# EAGLE design RCPCell (EAGLE 6.5.0)
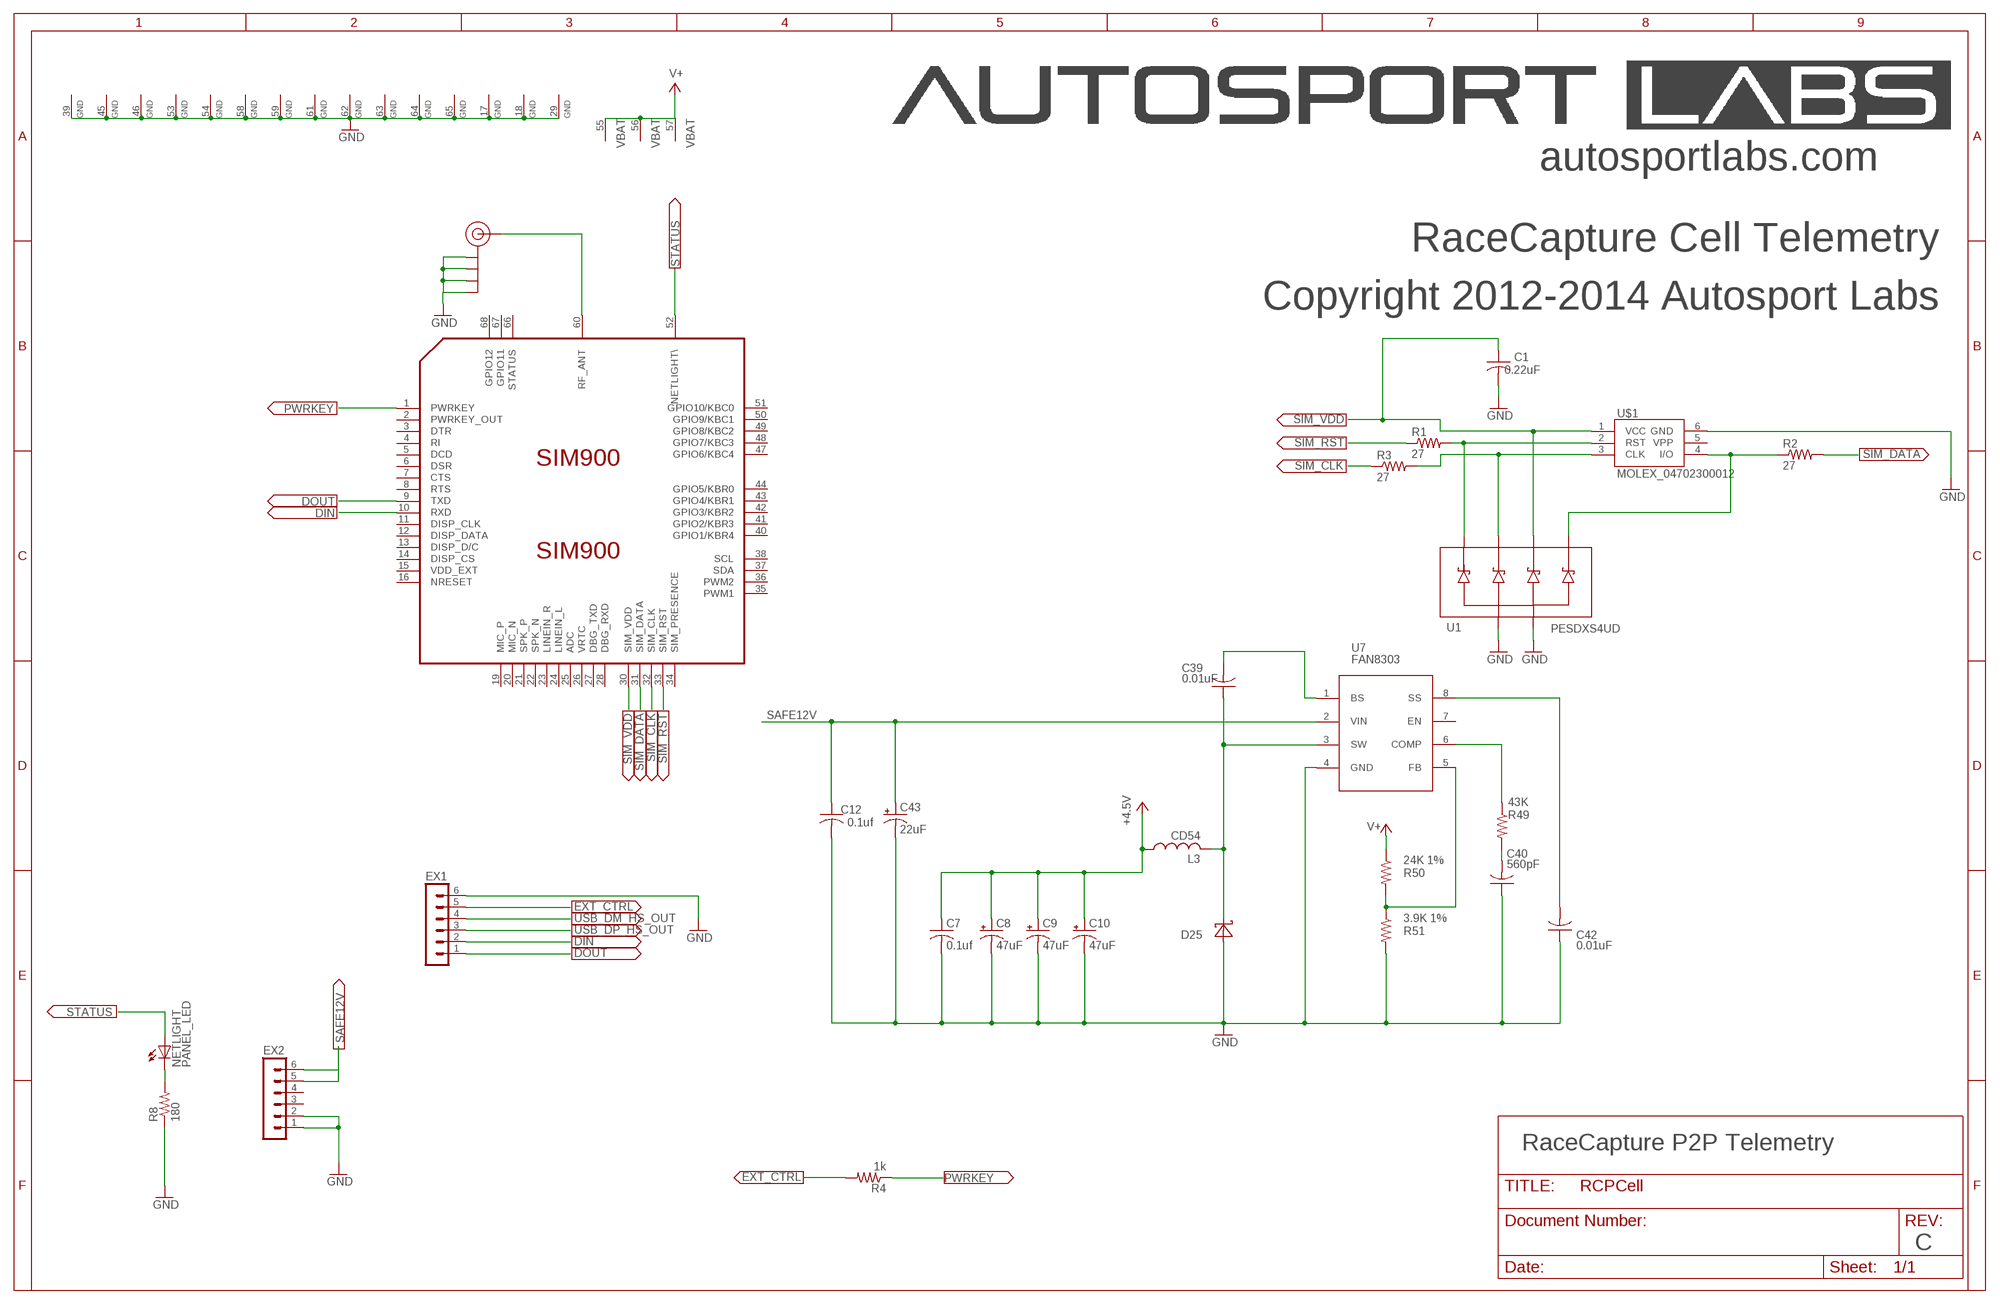
[diagram p0: schematic, sheet 1]

## Parts
C1  0.22uF  C-USC0603  [C0603]
C7  0.1uf  C-USC0603  [C0603]
C8  47uF  CPOL-USSMCD  [SMC_D]
C9  47uF  CPOL-USSMCD  [SMC_D]
C10  47uF  CPOL-USSMCD  [SMC_D]
C12  0.1uf  C-USC0603  [C0603]
C39  0.01uF  C-USC0603  [C0603]
C40  560pF  C-USC0603  [C0603]
C42  0.01uF  C-USC0603  [C0603]
C43  22uF  CPOL-US153CLV-0605  [153CLV-0605]
D25  SCHOTTKY  [SMA]
EX1  MA06-1  [MA06-1]
EX2  MA06-1  [MA06-1]
J$1  SMA_EDGE  [SMA-EDGE]
L3  CD54  [CD54]
NETLIGHT  PANEL_LED  [RIGHTANGLE_CML_5323F5]
R1  27  RESISTOR0603  [0603]
R2  27  RESISTOR0603  [0603]
R3  27  RESISTOR0603  [0603]
R4  1k  RESISTOR0603  [0603]
R8  180  RESISTOR0603  [0603]
R49  43K  R-US_R0603  [R0603]
R50  24K 1%  R-US_R0603  [R0603]
R51  3.9K 1%  R-US_R0603  [R0603]
SIM900  SIM900  [SIM900]
U1  PESDXS4UD  [SC-74]
U7  FAN8303  [SO-8]
U$1  MOLEX_04702300012  [MOLEX_91228-3001]

## Nets
DIN: EX1.2 SIM900.10(RXD)
DOUT: EX1.1 SIM900.9(TXD)
EXT_CTRL: EX1.5 R4.2
GND: C1.2 C7.2 C8.- C9.- C10.- C12.2 C40.1 C42.1 C43.- D25.A EX1.6 EX2.1 EX2.2 J$1.GND@0(GND) J$1.GND@1(GND) J$1.GND@2(GND) J$1.GND@3(GND) R8.1 R51.2 SIM900.17(GND) SIM900.18(GND) SIM900.29(GND) SIM900.39(GND) SIM900.45(GND) SIM900.46(GND) SIM900.53(GND) SIM900.54(GND) SIM900.58(GND) SIM900.59(GND) SIM900.61(GND) SIM900.62(GND) SIM900.63(GND) SIM900.64(GND) SIM900.65(GND) U1.2 U1.5 U7.4(GND) U$1.6(GND)
N$1: NETLIGHT.C R8.2
N$800: R50.2 R51.1 U7.5(FB)
N$900: C39.2 U7.1(BS)
N$1000: C39.1 D25.C L3.P$2 U7.3(SW)
N$1100: C40.2 R49.2
N$1200: R49.1 U7.6(COMP)
N$1300: C42.2 U7.8(SS)
PWRKEY: R4.1 SIM900.1(PWRKEY)
RF_ANT: J$1.SIG(SIGNAL) SIM900.60(RF_ANT)
SAFE12V: C12.1 C43.+ EX2.5 EX2.6 U7.2(VIN)
SIM_CLK: R3.1 SIM900.32(SIM_CLK)
SIM_CLK_CARD: R3.2 U1.3 U$1.3(CLK)
SIM_DATA: R2.2 SIM900.31(SIM_DATA)
SIM_DATA_CARD: R2.1 U1.6 U$1.4(I/O)
SIM_RST: R1.1 SIM900.33(SIM_RST)
SIM_RST_CARD: R1.2 U1.1 U$1.2(RST)
SIM_VDD: C1.1 SIM900.30(SIM_VDD) U1.4 U$1.1(VCC)
STATUS: NETLIGHT.A SIM900.52(NETLIGHT\)
USB_DM_HS_OUT: EX1.4
USB_DP_HS_OUT: EX1.3
V+: C7.1 C8.+ C9.+ C10.+ L3.P$1 R50.1 SIM900.55(VBAT) SIM900.56(VBAT) SIM900.57(VBAT) ; supply symbol labelled +4.5V
Unconnected: EX2.3 EX2.4 SIM900.2(PWRKEY_OUT) SIM900.3(DTR) SIM900.4(RI) SIM900.5(DCD) SIM900.6(DSR) SIM900.7(CTS) SIM900.8(RTS) SIM900.11(DISP_CLK) SIM900.12(DISP_DATA) SIM900.13(DISP_D/C) SIM900.14(DISP_CS) SIM900.15(VDD_EXT) SIM900.16(NRESET) SIM900.19(MIC_P) SIM900.20(MIC_N) SIM900.21(SPK_P) SIM900.22(SPK_N) SIM900.23(LINEIN_R) SIM900.24(LINEIN_L) SIM900.25(ADC) SIM900.26(VRTC) SIM900.27(DBG_TXD) SIM900.28(DBG_RXD) SIM900.34(SIM_PRESENCE) SIM900.35(PWM1) SIM900.36(PWM2) SIM900.37(SDA) SIM900.38(SCL) SIM900.40(GPIO1/KBR4) SIM900.41(GPIO2/KBR3) SIM900.42(GPIO3/KBR2) SIM900.43(GPIO4/KBR1) SIM900.44(GPIO5/KBR0) SIM900.47(GPIO6/KBC4) SIM900.48(GPIO7/KBC3) SIM900.49(GPIO8/KBC2) SIM900.50(GPIO9/KBC1) SIM900.51(GPIO10/KBC0) SIM900.66(STATUS) SIM900.67(GPIO11) SIM900.68(GPIO12) U7.7(EN) U$1.5(VPP)

## Notes on the sheet
- autosportlabs.com
- RaceCapture Cell Telemetry
- Copyright 2012-2014 Autosport Labs
- RaceCapture P2P Telemetry
- C

## Library data of the parts
C1 C7 C12 C39 C40 C42 = rcl:C-US: CAPACITOR, American symbol
C8-C10 C43 = rcl:CPOL-US: POLARIZED CAPACITOR, American symbol
D25 = smt_diodes:SCHOTTKY
EX1 EX2 = con-lstb:MA06-1: PIN HEADER; OC_FARNELL: unknown; OC_NEWARK: unknown
J$1 = SparkFun:SMA_EDGE: SMA Antenna Connector End launch SMA connector. The paste layer has been removed so that the connector can be hand soldered onto the board after reflow.
L3 = sumida_inductors:CD54
NETLIGHT = LEDs:PANEL_LED
R1-R4 R8 = SparkFun:RESISTOR: Resistor Basic schematic elements and footprints for 0603, 1206, and PTH 1/10th watt (small) resistors.
R49-R51 = rcl:R-US_: RESISTOR, American symbol
SIM900 = sim900:SIM900
U1 = smt_diodes:PESDXS4UD
U7 = voltage_regulators:FAN8303
U$1 = simcard:MOLEX_0470230001

## Net classes
1 vcc: width 0.305 mm

## Board
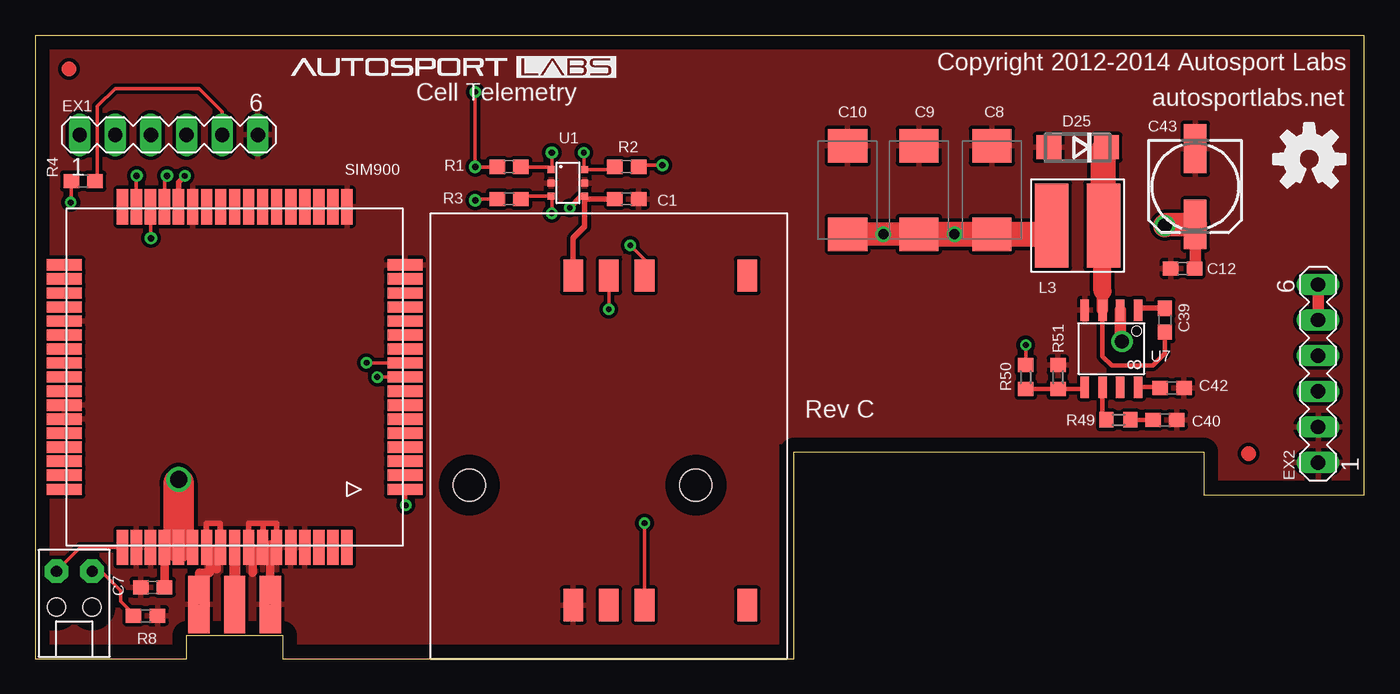
[diagram p1: board, top side]
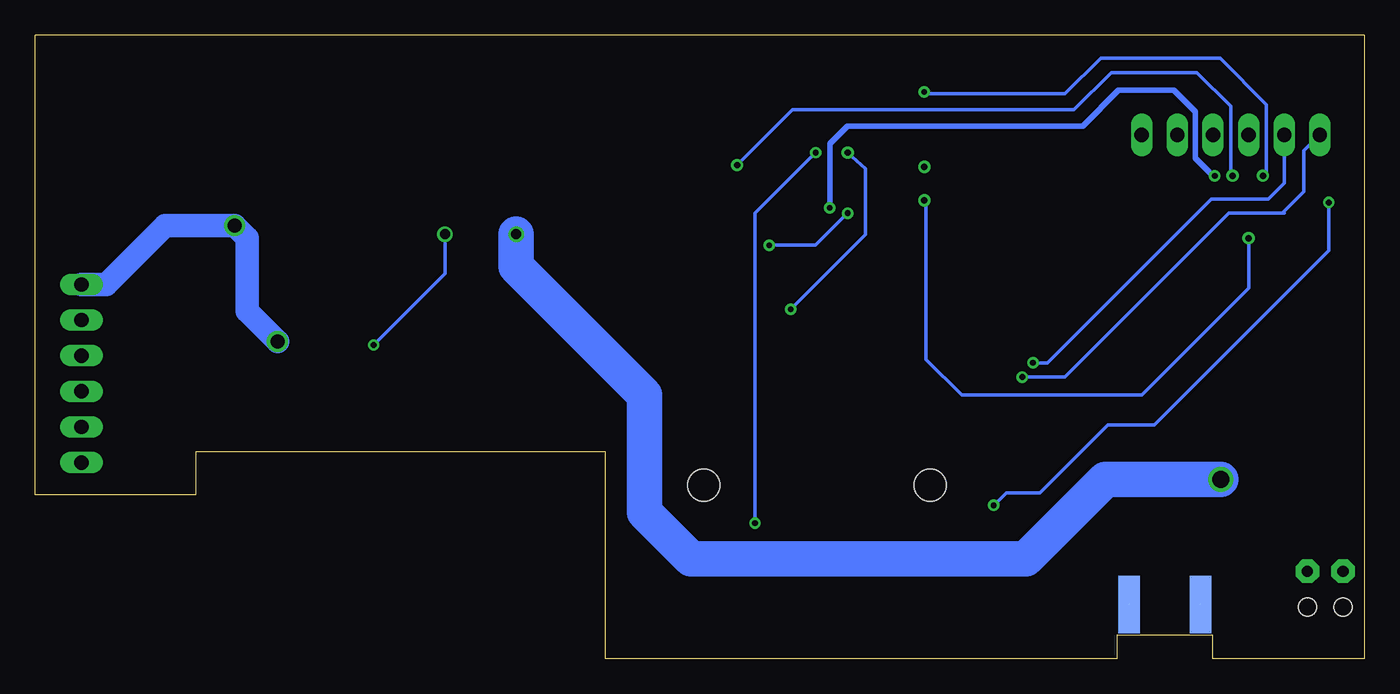
[diagram p2: board, bottom side, seen from below]

Size 94.74 x 44.45 mm. Coordinates in mm from the lower left corner, seen from the top.
Outline: 0,0 10.8,0 10.8,1.65 17.65,1.65 17.65,0 54.1,0 54.1,14.73 83.31,14.73 83.31,11.68 94.74,11.68 94.74,44.45 0,44.45 0,0
Copper layers (1*16): Top 0.035mm / dielectric 1.5mm / Bottom 0.035mm
Design rules "default *": minimum track width 8mil, minimum drill 16mil, track to track 8mil, track to pad 8mil, pad to pad 6mil, via to via 8mil, smd to smd 6mil, copper to edge 40mil, drill to drill 8mil, minimum pad ring 10mil, minimum via ring 8mil, stop-mask expansion 4mil, vias tented up to drill 19mil, thermal gap 10mil

### Footprints (pad centres in the part's own frame; a part is rotated, then mirrored left to right if it is on the bottom)
C0603 = smd 1.1 x 1: 1 -0.85,0; 2 0.85,0
SMC_D = smd 2.4 x 2.8: + -3.15,0; - 3.15,0
153CLV-0605 = smd 3.5 x 1.6: + 2.7,0; - -2.7,0
SMA = smd 1.8 x 1.7: A 2.05,0; C -2.05,0
MA06-1 = drill 1.016 long: 1 -6.35,0; 2 -3.81,0; 3 -1.27,0; 4 1.27,0; 5 3.81,0; 6 6.35,0
SMA-EDGE = smd 1.524 x 4.064: GND@0 0,0; GND@1 5.08,0; SIG 2.54,0 | smd 1.524 x 4.064 bottom: GND@2 0,0; GND@3 5.08,0
CD54 = smd 6 x 2.4: P$1 0,1.85; P$2 0,-1.85
RIGHTANGLE_CML_5323F5 = drill 0.8 pad 1.676 octagon: A -1.27,1.651; C 1.27,1.651 | hole 1.295: 1.27,-0.889; -1.27,-0.889
0603 = smd 1.1 x 1: 1 -0.85,0; 2 0.85,0
R0603 = smd 1 x 1.1: 1 -0.85,0; 2 0.85,0
SIM900 = smd 2.5 x 0.8: 1 -12.139,8; 2 -12.139,7; 3 -12.139,6; 4 -12.139,5; 5 -12.139,4; 6 -12.139,3; 7 -12.139,2; 8 -12.139,1; 9 -12.139,0; 10 -12.139,-1; 11 -12.139,-2; 12 -12.139,-3; 13 -12.139,-4; 14 -12.139,-5; 15 -12.139,-6; 16 -12.139,-7; 17 -12.139,-8; 35 12.139,-8; 36 12.139,-7; 37 12.139,-6; 38 12.139,-5; 39 12.139,-4; 40 12.139,-3; 41 12.139,-2; 42 12.139,-1; 43 12.139,0; 44 12.139,1; 45 12.139,2; 46 12.139,3; 47 12.139,4; 48 12.139,5; 49 12.139,6; 50 12.139,7; 51 12.139,8 | smd 0.8 x 2.5: 18 -8,-12.139; 19 -7,-12.139; 20 -6,-12.139; 21 -5,-12.139; 22 -4,-12.139; 23 -3,-12.139; 24 -2,-12.139; 25 -1,-12.139; 26 0,-12.139; 27 1,-12.139; 28 2,-12.139; 29 3,-12.139; 30 4,-12.139; 31 5,-12.139; 32 6,-12.139; 33 7,-12.139; 34 8,-12.139; 52 8,12.139; 53 7,12.139; 54 6,12.139; 55 5,12.139; 56 4,12.139; 57 3,12.139; 58 2,12.139; 59 1,12.139; 60 0,12.139; 61 -1,12.139; 62 -2,12.139; 63 -3,12.139; 64 -4,12.139; 65 -5,12.139; 66 -6,12.139; 67 -7,12.139; 68 -8,12.139
SC-74 = smd 0.5 x 0.5: 1 -0.95,-1.2; 2 0,-1.2; 3 0.95,-1.2; 4 0.95,1.2; 5 0,1.2; 6 -0.95,1.2
SO-8 = smd 1.524 x 0.61: 1 -2.743,1.905; 2 -2.743,0.635; 3 -2.743,-0.635; 4 -2.743,-1.905; 5 2.743,-1.905; 6 2.743,-0.635; 7 2.743,0.635; 8 2.743,1.905
MOLEX_91228-3001 = smd 1.4 x 2.3: 1 0,23.5; 2 2.54,23.5; 3 5.08,23.5; 4 5.08,0; 5 2.54,0; 6 0,0; 7 12.4,0; 8 12.4,23.5 | hole 2.3: -7.4,8.55; 8.74,8.55

### Placement (x,y rotation side)
C1  42.16,32.77 0 top
C7  8.38,5.08 180 top
C8  68.2,33.4 90 top
C9  62.99,33.4 90 top
C10  57.91,33.4 90 top
C12  81.79,27.81 180 top
C39  80.52,24.13 90 top
C40  80.52,17.02 180 top
C42  81.03,19.3 180 top
C43  82.68,33.66 270 top
D25  74.29,36.45 180 top
EX1  9.52,37.34 0 top
EX2  91.44,20.32 90 top
J$1  11.68,3.85 0 top
L3  74.29,30.86 90 top
NETLIGHT  2.79,4.57 0 top
R1  33.78,35.05 0 top
R2  42.16,35.05 0 top
R3  33.78,32.77 0 top
R4  3.43,34.04 0 top
R8  7.87,3.05 180 top
R49  77.22,17.02 0 top
R50  70.61,20.07 270 top
R51  72.9,20.07 90 top
SIM900  14.22,20.07 180 top
U1  37.97,33.91 270 top
U7  76.71,22.1 270 top
U$1  38.35,3.81 0 top

### Tracks (layer width: path | path; a pad name or v marks a point on that pad's centre or on a via)
DIN  (via drill 0.41)
  Top 0.254: v23.62,21.08 23.64,21.07 SIM900.10
  Bottom 0.254: v23.62,21.08 22.61,21.08 10.92,32.77 6.86,32.77 5.72,33.91 EX1.2
DOUT  (via drill 0.41)
  Top 0.254: v24.38,20.07 SIM900.9
  Bottom 0.254: v24.38,20.07 21.34,20.07 9.65,31.75 5.84,31.75 | EX1.1 4.32,36.2 4.32,33.27 5.84,31.75 | 5.84,31.75 5.72,31.75
EXT_CTRL
  Top 0.254: R4.2 4.45,34.04 4.45,39.37 5.72,40.64 11.68,40.64 13.34,38.99 EX1.5
GND  (2 unrouted)
  Top 0.254: 12.95,7.87 12.45,7.87 12.39,7.93 SIM900.58 | 15.49,7.87 16,7.87
  Top 0.406: SIM900.58 12.19,9.11 12.19,9.65 13.21,9.65 13.21,8.83 SIM900.59 | SIM900.63 17.22,9.64 17.02,9.65 16.26,9.65 | 16.26,9.65 16.26,8.85 SIM900.62 | SIM900.61 15.22,9.64 15.24,9.65 16.26,9.65
  Top 0.61: 11.68,5.08 11.68,6.1 12.45,6.1 12.45,7.87 | 12.95,6.35 12.95,7.87 | 15.49,6.1 15.49,7.87 | 16.76,5.84 16.76,8.13
  pour Top (isolate 0.254): 94.23,43.94 0.51,43.94 0.51,0.51 52.83,0.51 52.83,15.49 84.07,15.49 84.07,12.7 94.23,12.7
N$1
  Top 0.254: R8.2 7.02,3.14 6.1,4.06 6.1,4.83 4.7,6.22 NETLIGHT.C
N$800
  Top 0.305: U7.5 74.66,19.22 R51.1 R50.2
N$900
  Top 0.406: C39.2 78.75,24.98 U7.1
N$1000
  Top 0.305: U7.3 76.07,21.54 76.73,20.88 79.65,20.88 80.52,21.74 C39.1
  Top 0.813: U7.3 76.07,26.19
  Top 1.27: 76.07,26.19 76.07,30.79 L3.P$2
  Top 1.778: L3.P$2 76.14,36.25 D25.C
N$1100
  Top 0.305: C40.2 R49.2
N$1200
  Top 0.305: R49.1 76.07,17.31 U7.6
N$1300
  Top 0.305: C42.2 80.12,19.36 U7.8
PWRKEY  (via drill 0.41)
  Top 0.254: R4.1 2.58,32.55 v2.54,32.51 | v26.42,10.92 26.42,12.01 SIM900.1
  Bottom 0.254: v2.54,32.51 2.54,29.08 14.99,16.64 18.29,16.64 23.11,11.81 25.53,11.81 v26.42,10.92
RF_ANT
  Top 0.787: SIM900.60 J$1.SIG
SAFE12V  (via drill 1)
  Top 0.813: v77.47,22.61 77.34,22.73 U7.2 | EX2.5 EX2.6 | C43.+ 82.68,28.11 C12.1
  Top 1.676: C43.+ 80.61,30.95 v80.52,30.86
  Bottom 1.676: EX2.6 89.66,26.67 85.47,30.86 v80.52,30.86 79.63,29.97 79.63,24.77 v77.47,22.61
SIM_CLK  (via drill 0.46)
  Top 0.254: SIM900.32 8.22,30.13 v8.25,29.97 | R3.1 31.34,32.77 v31.37,32.66
  Bottom 0.254: v8.25,29.97 8.25,26.42 15.88,18.8 28.7,18.8 31.24,21.34 31.24,32.54 v31.37,32.66
SIM_CLK_CARD  (via drill 0.41)
  Top 0.254: U$1.3 43.43,28.45 v42.42,29.46 | v36.83,31.75 36.83,32.9 U1.3 34.83,32.96 R3.2
  Bottom 0.254: v42.42,29.46 39.12,29.46 v36.83,31.75
SIM_DATA  (via drill 0.46)
  Top 0.254: SIM900.31 9.22,34.24 v9.4,34.42 | v44.7,35.18 43.14,35.18 R2.2
  Bottom 0.254: v9.4,34.42 9.52,34.54 9.52,39.37 11.94,41.78 18.03,41.78 20.7,39.12 40.77,39.12 v44.7,35.18
SIM_DATA_CARD  (via drill 0.41)
  Top 0.254: U$1.4 v43.43,9.65 | R2.1 41.12,34.86 U1.6 39.12,34.92 v39.12,36.07
  Bottom 0.254: v43.43,9.65 43.43,31.75 v39.12,36.07
SIM_RST  (via drill 0.41, 0.46)
  Top 0.254: SIM900.33 7.22,34.4 v7.24,34.42 | v31.37,40.39 v31.37,35.05 R1.1
  Bottom 0.254: v7.24,34.42 6.99,34.67 6.99,39.5 10.29,42.8 18.8,42.8 21.34,40.26 31.24,40.26 v31.37,40.39
SIM_RST_CARD  (via drill 0.41, 0.46)
  Top 0.254: U$1.2 v40.89,24.89 | R1.2 36.58,35.05 U1.1 36.83,34.92 v36.83,36.07
  Bottom 0.254: v40.89,24.89 35.56,30.23 35.56,34.92 v36.83,36.07
SIM_VDD  (via drill 0.41)
  Top 0.254: 39.37,32.77 U1.4 38.93,32.96
  Top 0.406: C1.1 39.37,32.77 | U1.4 39.17,30.79 38.35,29.97 U$1.1 | v38.1,32.13 38.93,32.96 | SIM900.30 10.22,33.97 v10.67,34.42
  Bottom 0.406: v38.1,32.13 38.1,36.7 36.83,37.97 20.07,37.97 17.53,40.51 13.59,40.51 12.07,38.99 12.07,35.69 10.8,34.42 v10.67,34.42
STATUS
  Top 0.254: SIM900.52 3.23,7.93 NETLIGHT.A
V+  (via drill 0.41, 0.7, 1.2)
  Top 0.254: R50.1 v70.61,22.35
  Top 0.61: SIM900.57 SIM900.56 SIM900.55 C7.1
  Top 0.813: v10.24,12.78 10.22,12.51
  Top 1.676: C10.+ v60.45,30.25 C9.+
  Top 1.778: C9.+ v65.53,30.25 C8.+ 71.83,30.25 L3.P$1
  Top 2.184: 10.22,12.51 SIM900.56
  Bottom 0.254: v70.61,22.35 65.53,27.43 v65.53,30.25
  Bottom 2.54: v10.24,12.78 18.47,12.78 24.13,7.11 48.01,7.11 51.31,10.41 51.31,18.8 60.45,27.94 v60.45,30.25
(copper drawn outside any net)
  shapes: Top circle x2

### Text on the board
tPlace: Copyright 2012-2014 Autosport Labs | autosportlabs.net | Cell Telemetry | Rev C